# Altium schematic sheet GLCD.SchDoc
size Tabloid; Organization: Altium Limited; Address1: L3, 12a Rodborough Rd; Address2: Frenchs Forest; Address3: NSW; Address4: Australia 2086; DocumentNumber: 2; SheetNumber: 2; SheetTotal: 8
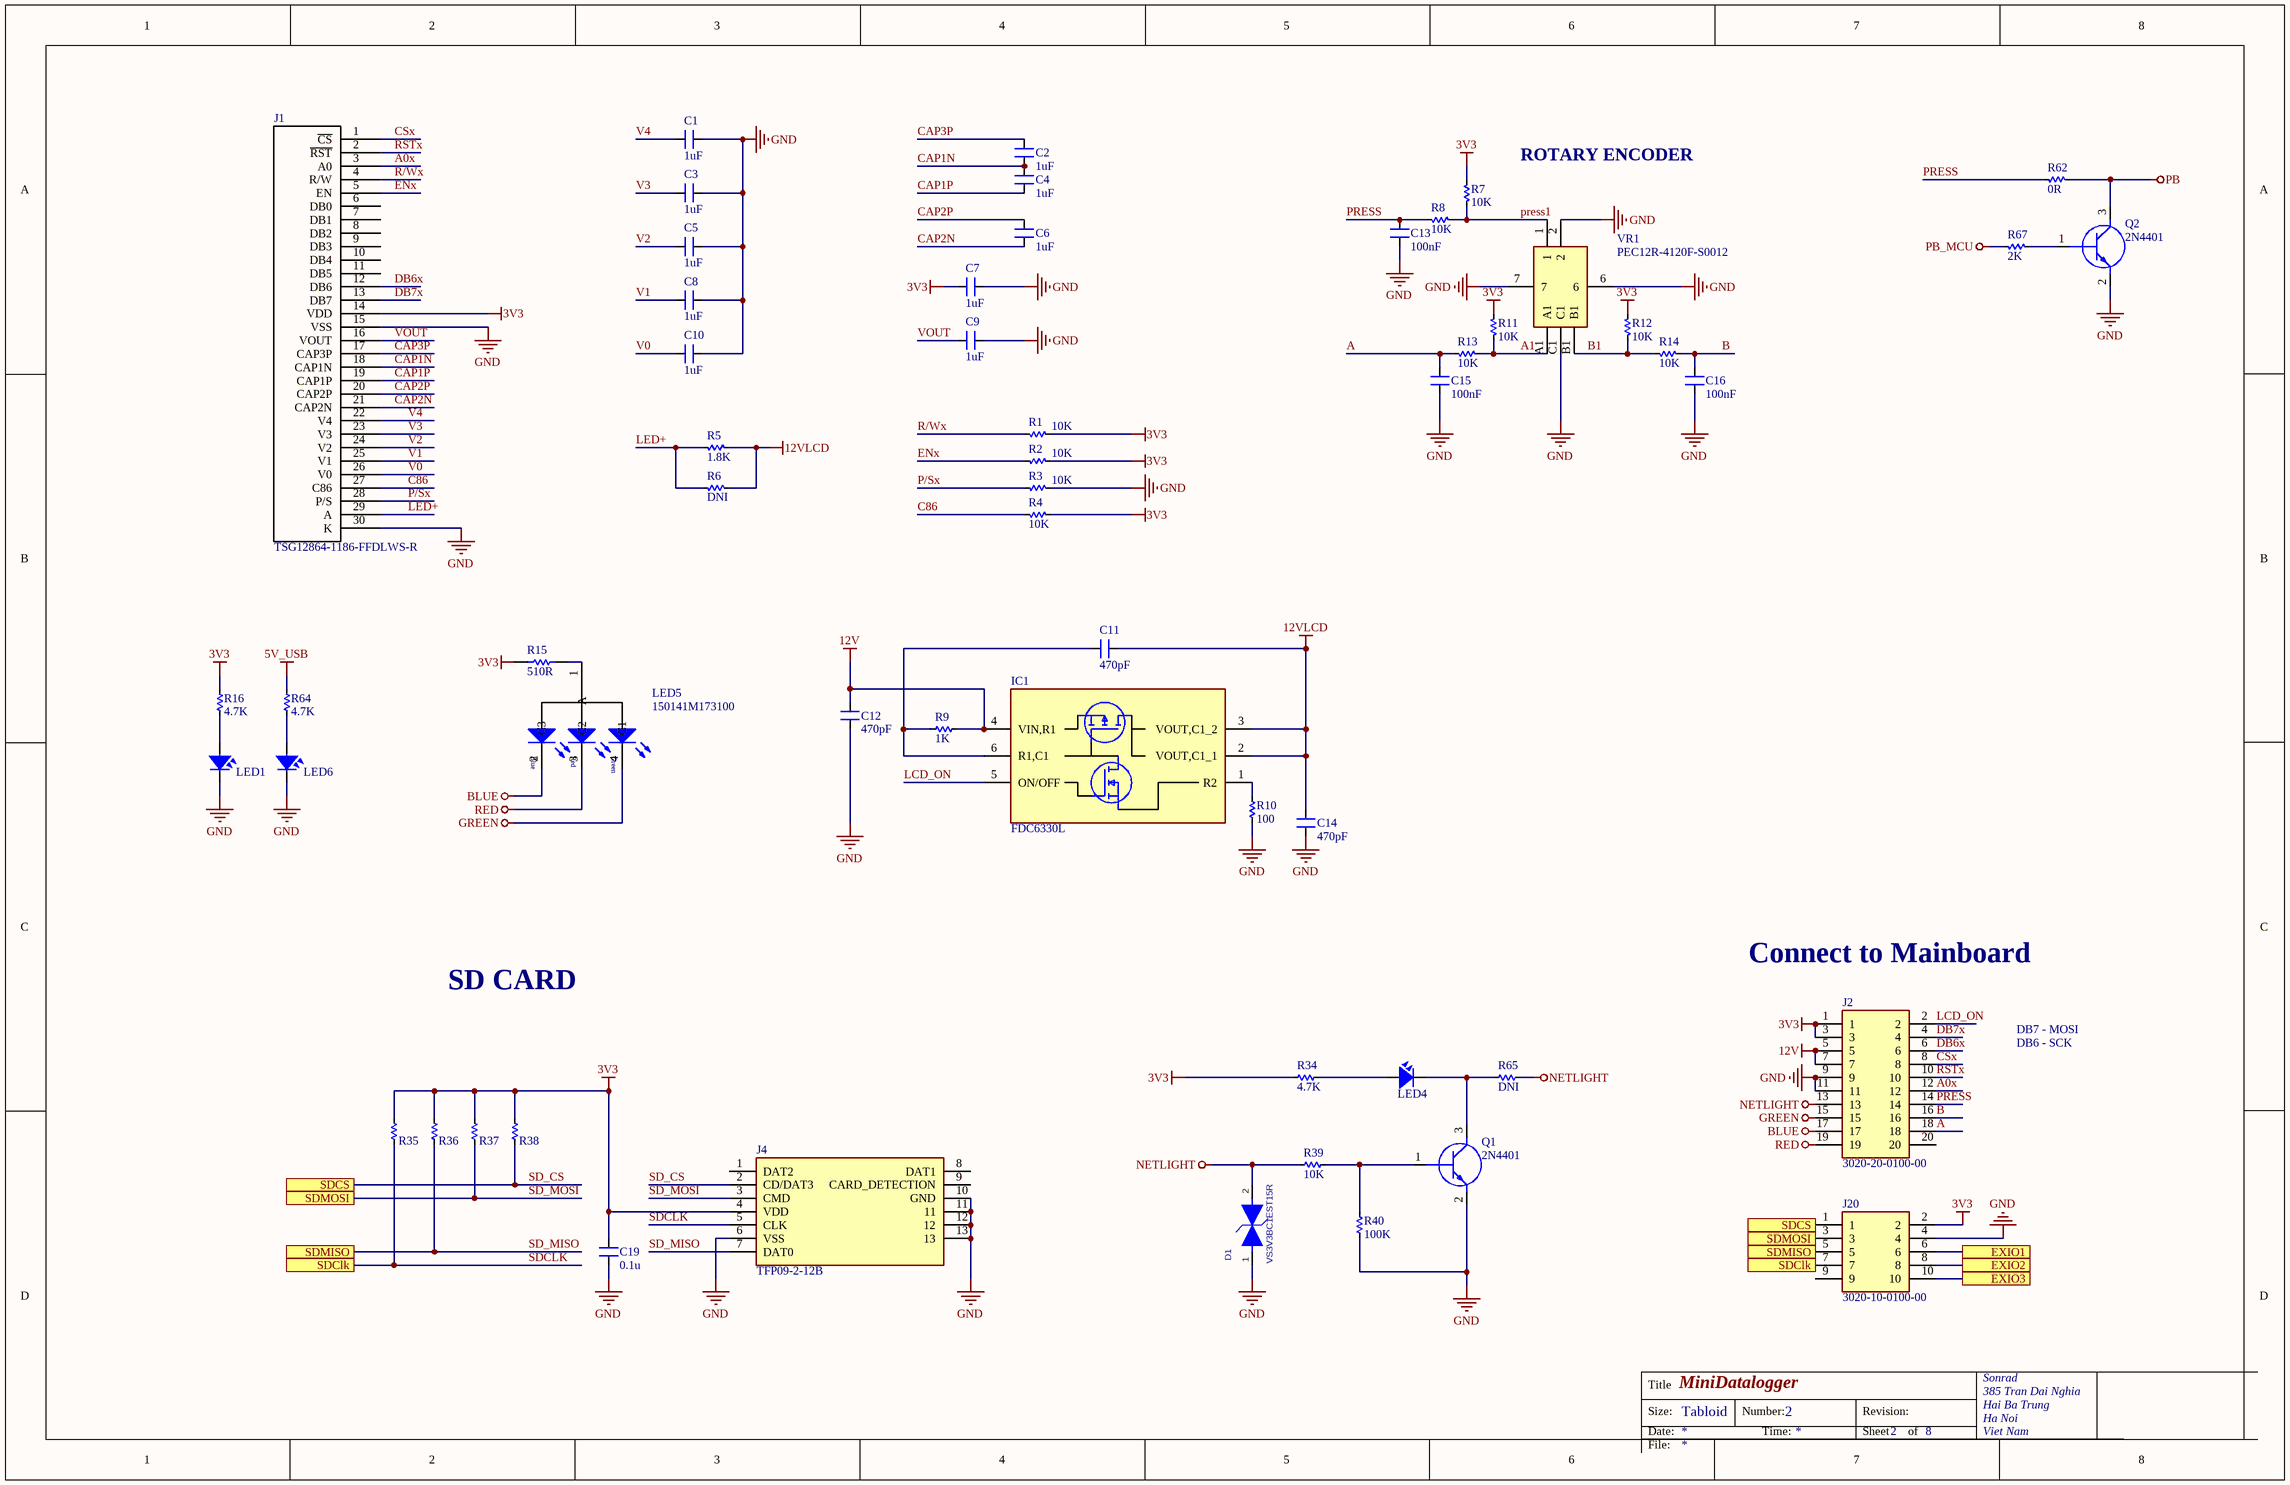
[diagram p0: GLCD.SchDoc]

## Parts
C1  1uF  [SM-0805]
C2  1uF  [SM-0805]
C3  1uF  [SM-0805]
C4  1uF  [SM-0805]
C5  1uF  [SM-0805]
C6  1uF  [SM-0805]
C7  1uF  [SM-0805]
C8  1uF  [SM-0805]
C9  1uF  [SM-0805]
C10  1uF  [SM-0805]
C11  470pF  [SM-0805]
C12  470pF  [SM-0805]
C13  100nF  [SM-0805]
C14  470pF  [SM-0805]
C15  100nF  [SM-0805]
C16  100nF  [SM-0805]
C19  0.1u  [SM-0805]
D1  value VS3V3BC1EST15R  [0603 RESISTOR]  (hidden comment: TVS_BI_ESD5431N-2/TR_DFN1006-2L)
IC1  FDC6330L  [SOT95P280X110-6N]
J1  TSG12864-1186-FFDLWS-R  [TGS2864-1186-FFDLWS-R]
J2  3020-20-0100-00  [SHDR20W65P254_2X10_3302X900X900P]
J4  TFP09-2-12B  [TFP09212B]
J20  3020-10-0100-00  [SHDR10W65P254_2X5_2032X880X920P]
LED1  LED  [LED 3512]  (value not drawn)
LED4  LED  [LED 3512]  (value not drawn)
LED5  150141M173100  [LED RGB 3528]
LED6  LED  [LED 3512]  (value not drawn)
Q1  2N4401  [SOT96P237X111-3N]
Q2  2N4401  [SOT96P237X111-3N]
R1  10K  [RES-SMD-0805]
R2  10K  [RES-SMD-0805]
R3  10K  [RES-SMD-0805]
R4  10K  [RES-SMD-0805]
R5  1.8K  [RES-SMD-0805]
R6  DNI  [RES-SMD-0805]
R7  10K  [RES-SMD-0805]
R8  10K  [RES-SMD-0805]
R9  1K  [RES-SMD-0805]
R10  100  [RES-SMD-0805]
R11  10K  [RES-SMD-0805]
R12  10K  [RES-SMD-0805]
R13  10K  [RES-SMD-0805]
R14  10K  [RES-SMD-0805]
R15  510R  [R2012-0805]
R16  4.7K  [RES-SMD-0805]
R34  4.7K  [RES-SMD-0805]
R35  100R  [RES-SMD-0805]  (value not drawn)
R36  100R  [RES-SMD-0805]  (value not drawn)
R37  100R  [RES-SMD-0805]  (value not drawn)
R38  100R  [RES-SMD-0805]  (value not drawn)
R39  10K  [RES-SMD-0805]
R40  100K  [RES-SMD-0805]
R62  0R  [RES-SMD-0805]
R64  4.7K  [RES-SMD-0805]
R65  DNI  [RES-SMD-0805]
R67  2K  [RES-SMD-0805]
VR1  PEC12R-4120F-S0012  [EC11-SMD-12.5mm]

## Ports
EXIO1, EXIO2, EXIO3, SDClk, SDCS, SDMISO, SDMOSI

## Nets
3V3: C7.1 C19.2 J1.14(VDD) J2.1 J2.3 J4.4(VDD) J20.2 R1.2 R2.2 R4.2 R7.2 R11.2 R12.2 R15.2 R16.1 R34.2 R35.2 R36.2 R37.2 R38.2
5V_USB: R64.1
12V: C12.2 IC1.4(VIN,R1) J2.5 J2.7 R9.1
12VLCD: C11.2 C14.1 IC1.2(VOUT,C1_1) IC1.3(VOUT,C1_2) R5.2 R6.2
BLUE: J2.17 LED5.2(C3)
GND: C1.1 C3.1 C5.1 C7.2 C8.1 C9.2 C10.1 C12.1 C13.1 C14.2 C15.1 C16.1 C19.1 D1.1 J1.15(VSS) J1.30(K) J2.9 J2.11 J4.6(VSS) J4.10(GND) J4.11 J4.12 J4.13 J20.4 LED1.2 LED6.2 Q1.2(E) Q2.2(E) R3.2 R10.1 R40.1 VR1.2 VR1.6 VR1.7 VR1.C1
GREEN: J2.15 LED5.4(C1)
NETLIGHT: D1.2 J2.13 R39.2 R65.1
PB: Q2.3(C) R62.1
PB_MCU: R67.2
RED: J2.19 LED5.3(C2)
A: C15.2 J2.18 R13.1
A0x: J1.3(A0) J2.12
A1: R11.1 R13.2 VR1.A1
B: C16.2 J2.16 R14.2
B1: R12.1 R14.1 VR1.B1
C86: J1.27(C86) R4.1
CAP1N: C2.2 C4.1 J1.18(CAP1N)
CAP1P: C4.2 J1.19(CAP1P)
CAP2N: C6.2 J1.21(CAP2N)
CAP2P: C6.1 J1.20(CAP2P)
CAP3P: C2.1 J1.17(CAP3P)
CSx: J1.1(~{CS}) J2.8
DB6x: J1.12(DB6) J2.6
DB7x: J1.13(DB7) J2.4
ENx: J1.5(EN) R2.1
EXIO1: J20.6 ; port EXIO1
EXIO2: J20.8 ; port EXIO2
EXIO3: J20.10 ; port EXIO3
LCD_ON: IC1.5(ON/OFF) J2.2
LED+: J1.29(A) R5.1 R6.1
P/Sx: J1.28(P/S) R3.1
PRESS: C13.2 J2.14 R8.2 R62.2
press1: R7.1 R8.1 VR1.1
R/Wx: J1.4(R/W) R1.1
RSTx: J1.2(~{RST}) J2.10
SD_CS: J4.2(CD/DAT3) J20.1 R38.1 ; port SDCS
SD_MISO: J4.7(DAT0) J20.5 R36.1 ; port SDMISO
SD_MOSI: J4.3(CMD) J20.3 R37.1 ; port SDMOSI
SDCLK: J4.5(CLK) J20.7 R35.1 ; port SDClk
V0: C10.2 J1.26(V0)
V1: C8.2 J1.25(V1)
V2: C5.2 J1.24(V2)
V3: C3.2 J1.23(V3)
V4: C1.2 J1.22(V4)
VOUT: C9.1 J1.16(VOUT)
NetC11_1: C11.1 IC1.6(R1,C1) R9.2
NetIC1_1: IC1.1(R2) R10.2
NetLED1_1: LED1.1 R16.2
NetLED4_1: LED4.1 R34.1
NetLED4_2: LED4.2 Q1.3(C) R65.2
NetLED5_1: LED5.1(A) R15.1
NetLED6_1: LED6.1 R64.2
NetQ1_1: Q1.1(B) R39.1 R40.2
NetQ2_1: Q2.1(B) R67.1

Not connected (* = marked no-connect by the designer): J1 6(DB0) 7(DB1) 8(DB2) 9(DB3) 10(DB4) 11(DB5); J2 20; J4 1(DAT2) 8(DAT1) 9(CARD_DETECTION); J20 9

## Notes on the sheet
- ROTARY ENCODER
- Connect to Mainboard
- SD CARD
- DB7 - MOSI
- DB6 - SCK
- Title
- Size:
- Date:
- MiniDatalogger
- Tabloid
- Number:
- Time:
- Revision:
- Sheet
- of
- Sonrad
- 385 Tran Dai Nghia
- Hai Ba Trung
- Ha Noi
- Viet Nam
- File:
- (in symbol LED RGB SMD) Blue; Red; Green

## Library data of the parts
C1-C16 C19 = CM: Cap SMD; Value: 103
D1 = TVS_BI_ESD5431N-2/TR_DFN1006-2L: Ppp:100W;Vrwm:±3.3V;Vbr:3.4V min;Vc:10.0V;Ipp:10.0A;Cj:17.5pF typ;ESD Voltage:±30KV(air);±30KV(contact);Tj:-55℃ to 150℃; MFR: WILL; Geometry.Height: 0.5mm; SN: 40300027; TYPE: TVS管; DESC: TVS_Bi-directional_3.3V_DFN1006-2L; MPN: ESD5431N-2/TR; PCB Footprint: DFN1006-2L; PCB DECAL: DFN1006-2L
IC1 = FDC6330L: Integrated Circuit; Manufacturer_Name: ON Semiconductor; Datasheet Link: http://docs-emea.rs-online.com/webdocs/10df/0900766b810df4e7.pdf; Height: 1.1mm; Manufacturer_Part_Number: FDC6330L; Mouser Part Number: 512-FDC6330L; Mouser Price/Stock: https://www.mouser.co.uk/ProductDetail/ON-Semiconductor-Fairchild/FDC6330L?qs=efMQ9B2bthfkfJJoj5%252B07g%3D%3D; Arrow Part Number: FDC6330L; Arrow Price/Stock: https://www.arrow.com/en/products/fdc6330l/on-semiconductor
J2 = 3020-20-0100-00: Connector; Manufacturer_Name: CNC Tech; Datasheet Link: http://cnctech.us/pdfs/3020-XX-0100-00.pdf; Height: 9mm; Manufacturer_Part_Number: 3020-20-0100-00; Arrow Part Number: 3020-20-0100-00; Arrow Price/Stock: https://www.arrow.com/en/products/3020-20-0100-00/cnc-tech-llc
J4 = TFP09-2-12B: Connector; Manufacturer_Name: 100y; Datasheet Link: http://images.100y.com.tw/pdf_file/10-TFP09-2-12B.pdf; Height: 2.45mm; Manufacturer_Part_Number: TFP09-2-12B
J20 = 3020-10-0100-00: Connector; Manufacturer_Name: CNC Tech; Datasheet Link: http://cnctech.us/pdfs/3020-XX-0100-00.pdf; Height: 9.2mm; Manufacturer_Part_Number: 3020-10-0100-00; Arrow Part Number: 3020-10-0100-00; Arrow Price/Stock: https://www.arrow.com/en/products/3020-10-0100-00/cnc-tech-llc
LED1 LED4 LED6 = LED SMD: Value: LED 3 - 5 ly 2 Colour
LED5 = LED RGB SMD: SMD Full-Color Top LED, WL-SFTW, Red & Green & Blue; Manufacturer: Würth Elektronik eiSos GmbH; PartNo: 150141M173100; ComponentLink1Description: Manufacturer; ComponentLink1URL: http://www.we-online.de; Created by: Christin Otto; Created Date: June 2013; ComponentLink2Description: Datasheet; ComponentLink2URL: http://katalog.we-online.com/led/datasheet/150141M173100.pdf; Color: Red & Green & Blue
Q1 Q2 = SBC848BLT1G: Transistor BJT NPN; Manufacturer_Name: ON Semiconductor; Datasheet Link: http://www.onsemi.com/pub/Collateral/BC846ALT1-D.PDF; Height: 1.11mm; Manufacturer_Part_Number: SBC848BLT1G; Mouser Part Number: 863-SBC848BLT1G; Mouser Price/Stock: https://www.mouser.co.uk/ProductDetail/ON-Semiconductor/SBC848BLT1G?qs=VZpK7o2ExSTLObuTFok7EA%3D%3D; Arrow Part Number: SBC848BLT1G; Arrow Price/Stock: https://www.arrow.com/en/products/sbc848blt1g/on-semiconductor
R1-R14 R16 R34-R40 R62 R64 R65 R67 = Res-SMD: Resistor; Manufacturer: Generic Components; Class: Passive; Published: 08/06/2000; Publisher: Altium Hobart Technology Centre
R15 = Res_0_5%_0402: Resistor; Manuf_Part_1: RC0402JR-070RL; Manuf_1: YAGEO; Value: 0; Order: 2363467; ECCN_US/EU: n/a; Distrib: FARNELL
VR1 = PEC12R-4120F-S0012: Variable Resistor; Manufacturer_Name: Bourns; Datasheet Link: https://componentsearchengine.com/Datasheets/1/PEC12R-4120F-S0012.pdf; Height: 20mm; Manufacturer_Part_Number: PEC12R-4120F-S0012; Mouser Part Number: 652-PEC12R-4120F-S12; Mouser Price/Stock: https://www.mouser.co.uk/ProductDetail/Bourns/PEC12R-4120F-S0012?qs=Zq5ylnUbLm6clFsEUuj3oA%3D%3D; Arrow Part Number: PEC12R-4120F-S0012; Arrow Price/Stock: https://www.arrow.com/en/products/pec12r-4120f-s0012/bourns